# Altium project 003-00005.PrjPcb
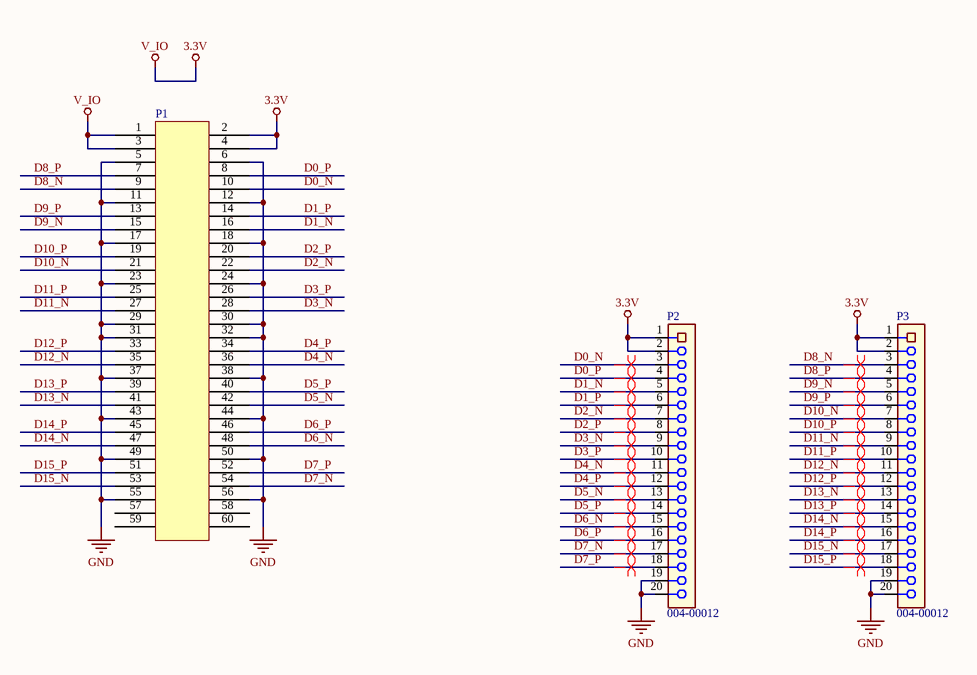
[diagram p0: 003-00005.SchDoc]
copyrightDate: 2014; DrillDrawingRevision: A; PCBPartNumber: 001-00005
1 sheet, 3 parts. Net scope: global (net labels, ports and power ports of the same name join across sheets).
Board file: 003-00005.PcbDoc

## Sheet 003-00005.SchDoc: <title>
size C; Organization: Custom Embedded Solutions, LLC.; Address1: 130 Oakland Trace; Address2: Madison, AL 35758; DocumentNumber: 1; Revision: <Rev>; SheetNumber: 1; SheetTotal: 1; PageTitle: Top Level (& only)

### Parts
P1  (no value)  [005-00024]  (no BOM)
P2  004-00012  [005-00014]
P3  004-00012  [005-00014]

### Nets
3.3V: P1.1 P1.2 P1.3 P1.4 P2.1 P2.2 P3.1 P3.2  [also labelled V_IO]
GND: P1.5 P1.6 P1.11 P1.12 P1.17 P1.18 P1.23 P1.24 P1.29 P1.30 P1.31 P1.32 P1.37 P1.38 P1.43 P1.44 P1.49 P1.50 P1.55 P1.56 P2.19 P2.20 P3.19 P3.20
D0_N: P1.10 P2.3
D0_P: P1.8 P2.4
D1_N: P1.16 P2.5
D1_P: P1.14 P2.6
D2_N: P1.22 P2.7
D2_P: P1.20 P2.8
D3_N: P1.28 P2.9
D3_P: P1.26 P2.10
D4_N: P1.36 P2.11
D4_P: P1.34 P2.12
D5_N: P1.42 P2.13
D5_P: P1.40 P2.14
D6_N: P1.48 P2.15
D6_P: P1.46 P2.16
D7_N: P1.54 P2.17
D7_P: P1.52 P2.18
D8_N: P1.9 P3.3
D8_P: P1.7 P3.4
D9_N: P1.15 P3.5
D9_P: P1.13 P3.6
D10_N: P1.21 P3.7
D10_P: P1.19 P3.8
D11_N: P1.27 P3.9
D11_P: P1.25 P3.10
D12_N: P1.35 P3.11
D12_P: P1.33 P3.12
D13_N: P1.41 P3.13
D13_P: P1.39 P3.14
D14_N: P1.47 P3.15
D14_P: P1.45 P3.16
D15_N: P1.53 P3.17
D15_P: P1.51 P3.18

Not connected (* = marked no-connect by the designer): P1 57 58 59 60

### Layout directives
differential pair: D0_N, D0_P, D1_N, D1_P, D2_N, D2_P, D3_N, D3_P, D4_N, D4_P, D5_N, D5_P, D6_N, D6_P, D7_N, D7_P, D8_N, D8_P, D9_N, D9_P, D10_N, D10_P, D11_N, D11_P, D12_N, D12_P, D13_N, D13_P, D14_N, D14_P, D15_N, D15_P

### Notes on the sheet
- Copyright (c)
- Page Title
- Design Title
- Creative Commons License, http://creativecommons.org/licenses/by/4.0/legalcode
  This PCB design by Custom Embedded Solutions, LLC. is licensed under a Creative Commons Attribution 4.0 International License.
- Size:
- Date:
- File:
- C
- Document Number:
- Time:
- Sheet
- Rev:
- of

### Library data of the parts
P1 = 008-00005: Connector, PCB edge, MEC8, 30x2 Pin; Part Number: 008-00005; Package: Edge Connector, MEC8-30
P2 P3 = 017-00011: CONN RCPT 2x10; Manufacturer1 Part Number: 54102-S05-10LF; Manufacturer1: FCI; Manufacturer2 Part Number: TSHS-110-D-06-A-GT-LF; Circuits: 20; Part Number: 017-00011; Manufacturer2: Major League; Manufacturer3: Molex; Manufacturer3 Part Number: 10-89-7202; Type: Receptacle; Package: 2x10 100mil header

## Assembly variants
003-00005: all parts fitted